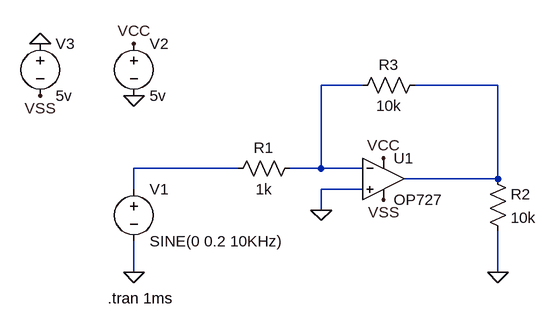
[diagram p0: schematic 6432154921-PB2.asc]
6432154921-PB2.asc, the LTspice schematic file:
Version 4
SHEET 1 880 680
WIRE 336 48 272 48
WIRE 544 48 416 48
WIRE 144 176 -16 176
WIRE 272 176 272 48
WIRE 272 176 224 176
WIRE 336 176 272 176
WIRE 544 192 544 48
WIRE 544 192 400 192
WIRE -16 208 -16 176
WIRE 336 208 272 208
WIRE 272 240 272 208
WIRE -16 336 -16 288
WIRE 544 336 544 272
FLAG -16 64 0
FLAG -16 336 0
FLAG -160 -16 0
FLAG 544 336 0
FLAG -160 64 VSS
FLAG -16 -16 VCC
FLAG 272 240 0
FLAG 368 160 VCC
FLAG 368 224 VSS
SYMBOL res 240 160 R90
WINDOW 0 0 56 VBottom 2
WINDOW 3 32 56 VTop 2
SYMATTR InstName R1
SYMATTR Value 1k
SYMBOL voltage -16 192 R0
WINDOW 123 0 0 Left 0
WINDOW 39 0 0 Left 0
SYMATTR InstName V1
SYMATTR Value SINE(0 0.2 10KHz)
SYMBOL voltage -16 -32 R0
WINDOW 123 0 0 Left 0
WINDOW 39 0 0 Left 0
SYMATTR InstName V2
SYMATTR Value 5v
SYMBOL voltage -160 -32 R0
WINDOW 123 0 0 Left 0
WINDOW 39 0 0 Left 0
SYMATTR InstName V3
SYMATTR Value 5v
SYMBOL Opamps\\OP727 368 128 R0
SYMATTR InstName U1
SYMBOL res 528 176 R0
SYMATTR InstName R2
SYMATTR Value 10k
SYMBOL res 432 32 R90
WINDOW 0 0 56 VBottom 2
WINDOW 3 32 56 VTop 2
SYMATTR InstName R3
SYMATTR Value 10k
TEXT -56 376 Left 2 !.tran 1ms

The netlist it stands for:
* 6432154921-PB2.asc
R1 N001 N003 1k
V1 N003 0 SINE(0 0.2 10KHz)
V2 VCC 0 5v
V3 0 VSS 5v
XU1 0 N001 VCC VSS N002 OP727  ; pins In+ In- V+ V- OUT
R2 N002 0 10k
R3 N002 N001 10k
.tran 1ms
.backanno
.end